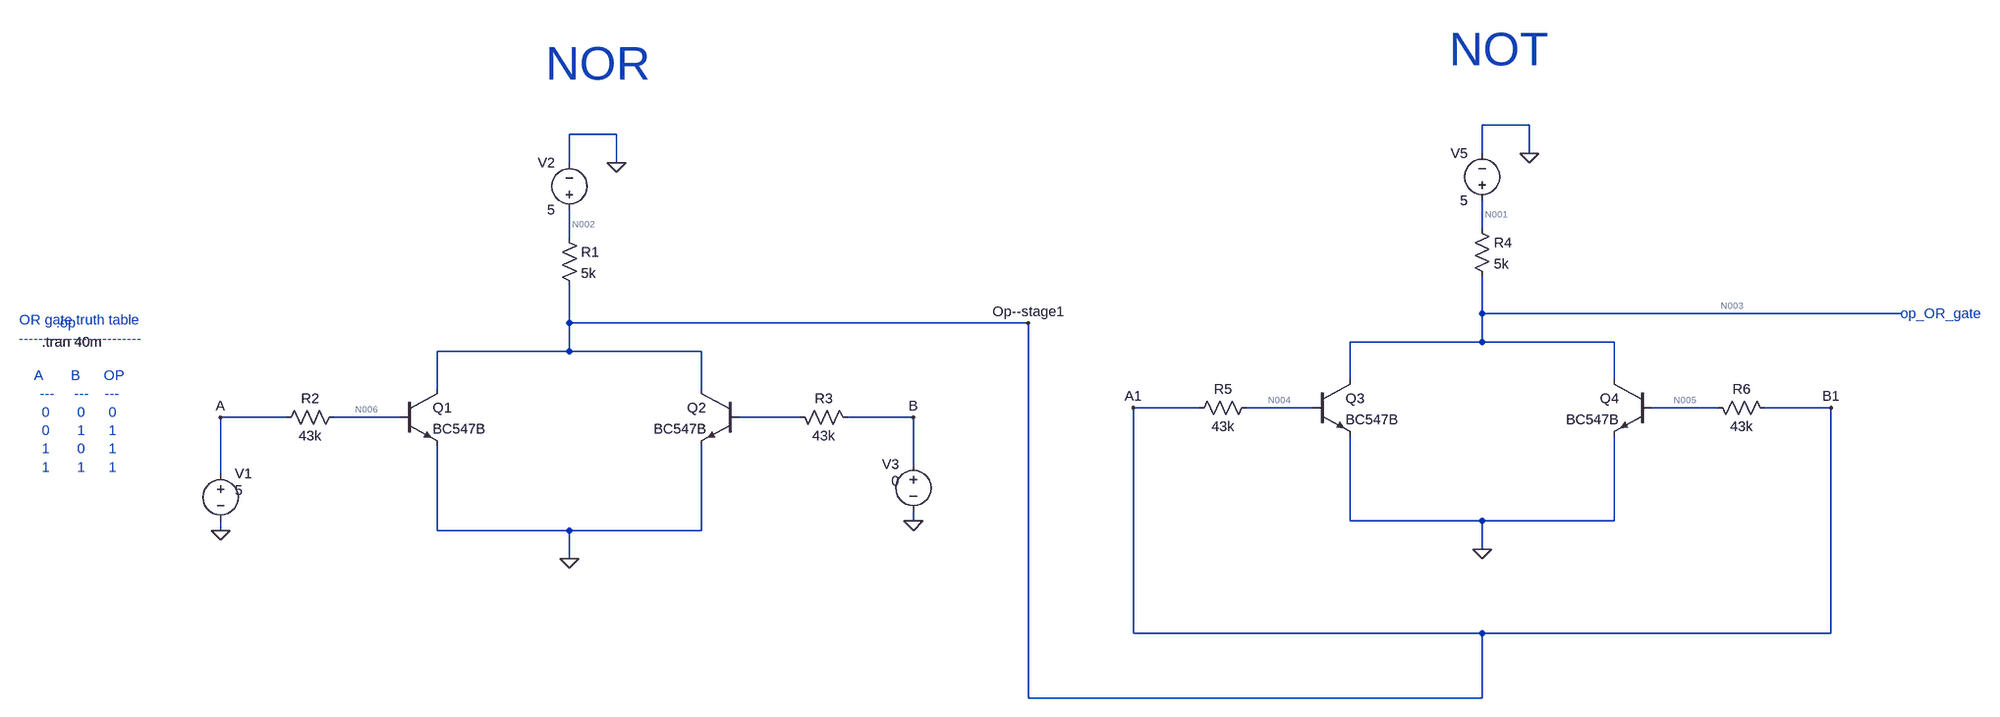
[diagram p0: schematic OR_using_NOR_gate.asc]
OR_using_NOR_gate.asc, the LTspice schematic file:
Version 4.1
SHEET 1 3092 1052
WIRE 2176 -288 2096 -288
WIRE 432 -272 352 -272
WIRE 2096 -240 2096 -288
WIRE 2176 -240 2176 -288
WIRE 352 -224 352 -272
WIRE 432 -224 432 -272
WIRE 2096 -112 2096 -160
WIRE 352 -96 352 -144
WIRE 2096 32 2096 -32
WIRE 2944 32 2096 32
WIRE 352 48 352 -16
WIRE 1184 48 352 48
WIRE 2096 80 2096 32
WIRE 2096 80 1872 80
WIRE 2320 80 2096 80
WIRE 352 96 352 48
WIRE 352 96 128 96
WIRE 576 96 352 96
WIRE 1872 144 1872 80
WIRE 2320 144 2320 80
WIRE 128 160 128 96
WIRE 576 160 576 96
WIRE 1616 192 1504 192
WIRE 1808 192 1696 192
WIRE 2496 192 2384 192
WIRE 2688 192 2576 192
WIRE -128 208 -240 208
WIRE 64 208 -48 208
WIRE 752 208 640 208
WIRE 944 208 832 208
WIRE 944 288 944 208
WIRE -240 304 -240 208
WIRE 944 384 944 368
WIRE 1872 384 1872 240
WIRE 2096 384 1872 384
WIRE 2320 384 2320 240
WIRE 2320 384 2096 384
WIRE -240 400 -240 384
WIRE 128 400 128 256
WIRE 352 400 128 400
WIRE 576 400 576 256
WIRE 576 400 352 400
WIRE 2096 432 2096 384
WIRE 352 448 352 400
WIRE 1504 608 1504 192
WIRE 2096 608 1504 608
WIRE 2688 608 2688 192
WIRE 2688 608 2096 608
WIRE 1184 768 1184 48
WIRE 2096 768 2096 608
WIRE 2096 768 1184 768
FLAG -240 208 A
FLAG -240 400 0
FLAG 944 208 B
FLAG 352 448 0
FLAG 432 -224 0
FLAG 1184 48 Op--stage1
FLAG 944 384 0
FLAG 1504 192 A1
FLAG 2688 192 B1
FLAG 2096 432 0
FLAG 2176 -240 0
SYMBOL voltage -240 288 R0
WINDOW 3 24 44 Left 2
WINDOW 123 0 0 Left 0
WINDOW 39 0 0 Left 0
SYMATTR Value 5
SYMATTR InstName V1
SYMBOL npn 64 160 R0
SYMATTR InstName Q1
SYMATTR Value BC547B
SYMBOL voltage 352 -128 R180
WINDOW 0 24 96 Left 2
WINDOW 3 24 16 Left 2
WINDOW 123 0 0 Left 0
WINDOW 39 0 0 Left 0
SYMATTR InstName V2
SYMATTR Value 5
SYMBOL res 336 -112 R0
SYMATTR InstName R1
SYMATTR Value 5k
SYMBOL res -32 192 R90
WINDOW 0 0 56 VBottom 2
WINDOW 3 32 56 VTop 2
SYMATTR InstName R2
SYMATTR Value 43k
SYMBOL npn 640 160 M0
SYMATTR InstName Q2
SYMATTR Value BC547B
SYMBOL res 736 192 M90
WINDOW 0 0 56 VBottom 2
WINDOW 3 32 56 VTop 2
SYMATTR InstName R3
SYMATTR Value 43k
SYMBOL voltage 944 272 M0
WINDOW 3 24 44 Left 2
WINDOW 123 0 0 Left 0
WINDOW 39 0 0 Left 0
SYMATTR Value 0
SYMATTR InstName V3
SYMBOL npn 1808 144 R0
SYMATTR InstName Q3
SYMATTR Value BC547B
SYMBOL voltage 2096 -144 R180
WINDOW 0 24 96 Left 2
WINDOW 3 24 16 Left 2
WINDOW 123 0 0 Left 0
WINDOW 39 0 0 Left 0
SYMATTR InstName V5
SYMATTR Value 5
SYMBOL res 2080 -128 R0
SYMATTR InstName R4
SYMATTR Value 5k
SYMBOL res 1712 176 R90
WINDOW 0 0 56 VBottom 2
WINDOW 3 32 56 VTop 2
SYMATTR InstName R5
SYMATTR Value 43k
SYMBOL npn 2384 144 M0
SYMATTR InstName Q4
SYMATTR Value BC547B
SYMBOL res 2480 176 M90
WINDOW 0 0 56 VBottom 2
WINDOW 3 32 56 VTop 2
SYMATTR InstName R6
SYMATTR Value 43k
TEXT -800 80 Left 2 !.tran 40m
TEXT -776 48 Left 2 ;.op
TEXT -736 168 Center 2 ;OR gate truth table\n-------------------------\n \nA       B      OP\n---     ---    ---\n0       0      0\n0       1      1\n1       0      1\n1       1      1
TEXT 2944 32 Left 2 ;op_OR_gate
TEXT 312 -392 Left 6 ;NOR
TEXT 2040 -416 Left 6 ;NOT

The netlist it stands for:
* OR_using_NOR_gate.asc
V1 A 0 5
Q1 B1 N006 0 0 BC547B
V2 N002 0 5
R1 N002 B1 5k
R2 N006 A 43k
Q2 B1 N007 0 0 BC547B
R3 N007 B 43k
V3 B 0 0
Q3 N003 N004 0 0 BC547B
V5 N001 0 5
R4 N001 N003 5k
R5 N004 B1 43k
Q4 N003 N005 0 0 BC547B
R6 N005 B1 43k
.model NPN NPN
.model PNP PNP
.lib standard.bjt
.tran 40m
* .op
* OR gate truth table
* -------------------------
* A       B      OP
* ---     ---    ---
* 0       0      0
* 0       1      1
* 1       0      1
* 1       1      1
* op_OR_gate
* NOR
* NOT
.backanno
.end

* Results of the author's LTspice run, read from the files saved beside the schematic
* Operating Point, zero values left out:
*   V(b1) = 31.02 mV
*   V(n002) = 5 V
*   V(n003) = 5 V
*   V(n005) = 31.02 mV
*   V(a) = 5 V
*   V(n006) = 653.2 mV
*   V(n004) = 31.02 mV
*   V(n001) = 5 V
*   I(V1) = -101.1 µA
*   I(R2) = -101.1 µA
*   I(R4) = 10.24 pA
*   I(R6) = 4.999 pA
*   I(V2) = -993.8 µA
*   Ic(Q4) = 5.121 pA
*   Ib(Q4) = -4.999 pA
*   Ic(Q1) = 993.8 µA
*   Ib(Q1) = 101.1 µA
*   Ie(Q1) = -1.095 mA
*   I(V5) = -10.24 pA
*   I(R5) = 4.999 pA
*   I(R1) = 993.8 µA
*   Ic(Q3) = 5.12 pA
*   Ib(Q3) = -4.999 pA